# EAGLE design OSO-MISC-22-001 Temperature + GPIO + I2C (EAGLE 9.6.2)
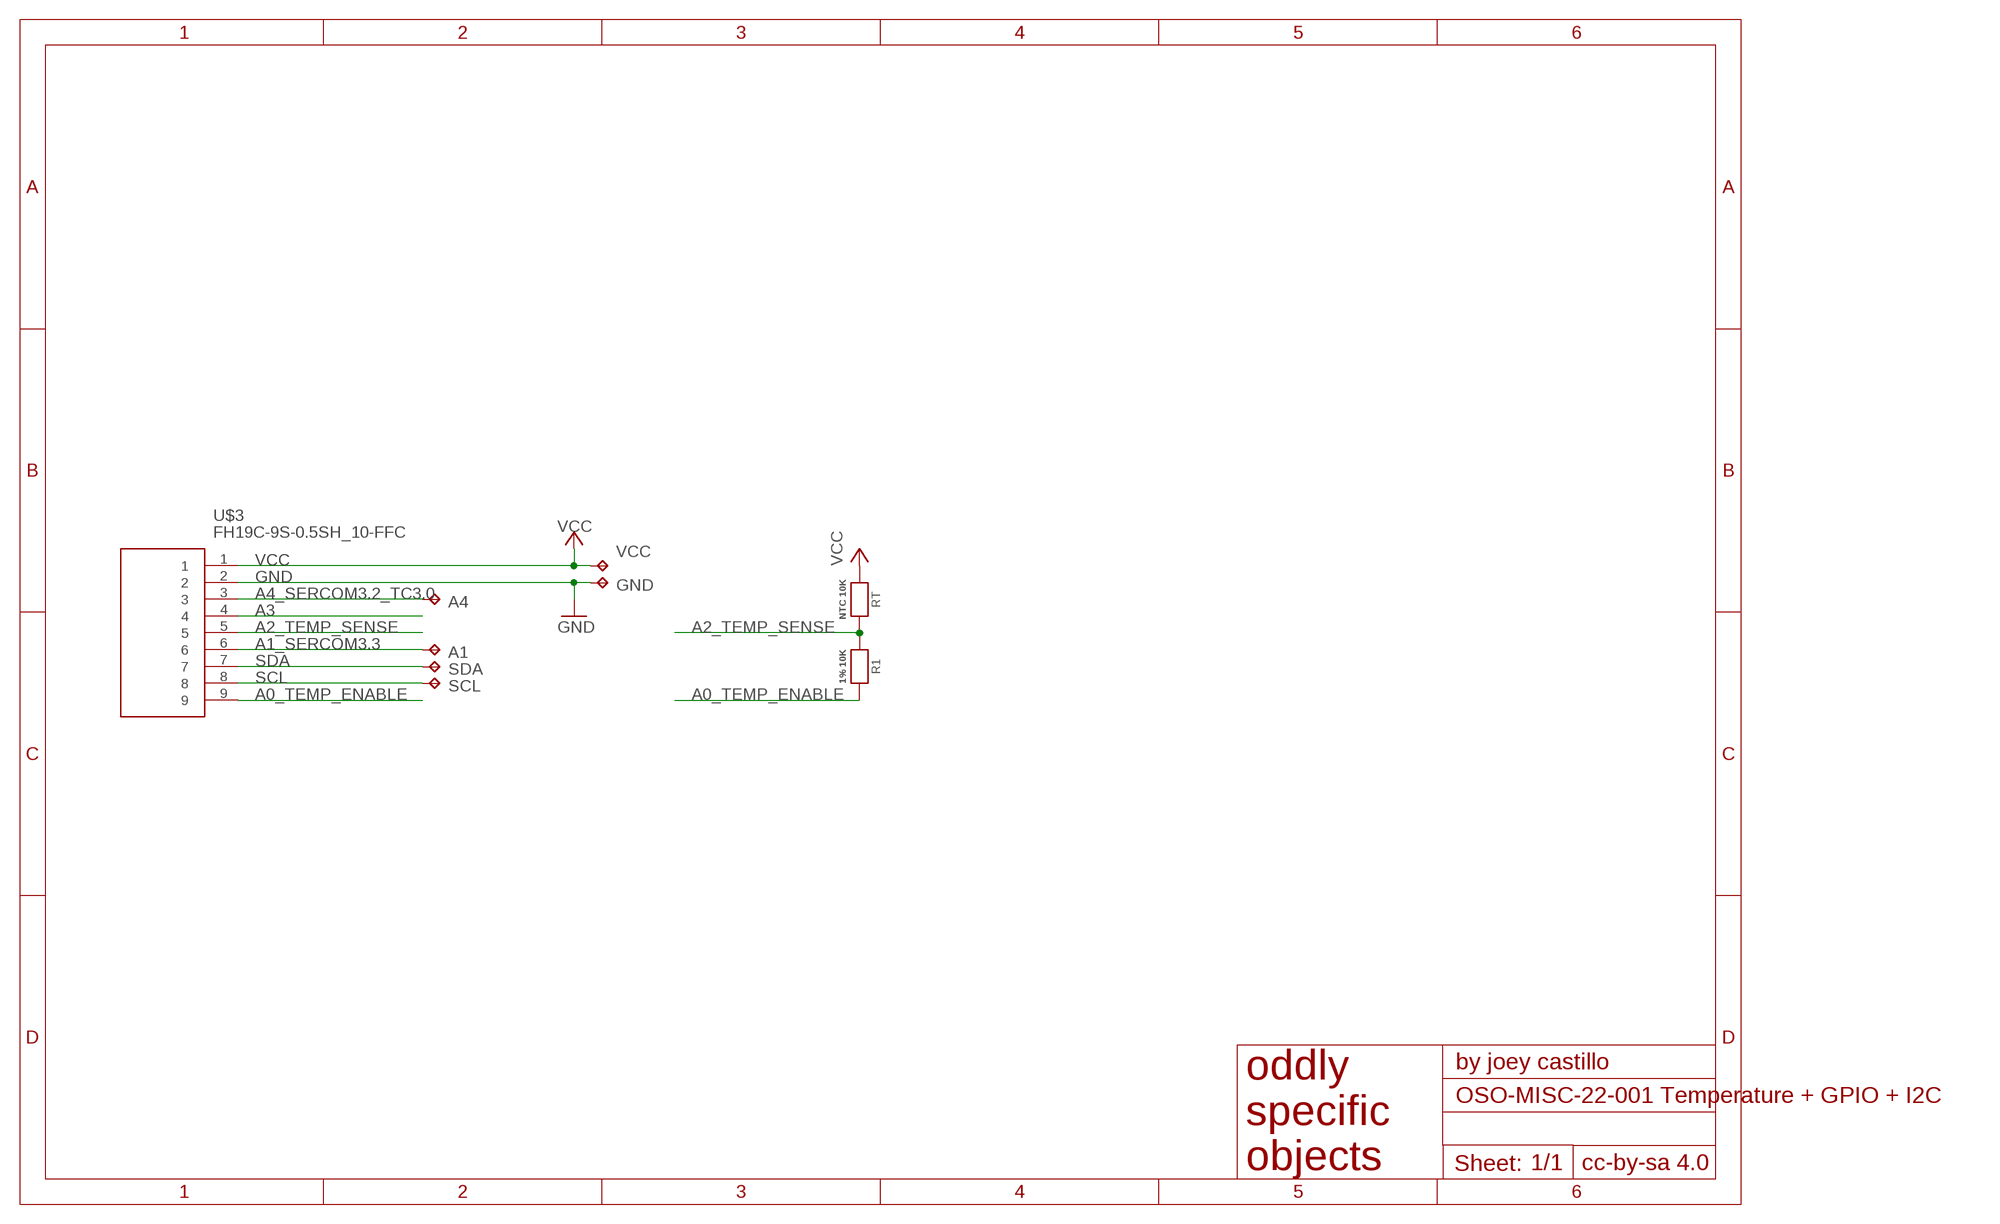
[diagram p0: schematic, sheet 1]

## Parts
A1  TPB1,27  [B1,27]
A4  TPB1,27  [B1,27]
GND  TPB1,27  [B1,27]
R1  1% 10K  RESISTOR_0603MP  [_0603MP]
RT  NTC 10K  RESISTOR_0603MP  [_0603MP]
SCL  TPB1,27  [B1,27]
SDA  TPB1,27  [B1,27]
U$3  FH19C-9S-0.5SH_10-FFC  [FH19C9S05SH10-FFC]
VCC  TPB1,27  [B1,27]

## Nets
A0_TEMP_ENABLE: R1.2 U$3.9
A1_SERCOM3.3: A1.TP U$3.6
A2_TEMP_SENSE: R1.1 RT.2 U$3.5
A3: U$3.4
A4_SERCOM3.2_TC3.0: A4.TP U$3.3
GND [gnd]: GND.TP U$3.2
SCL: SCL.TP U$3.8
SDA: SDA.TP U$3.7
VCC [power]: RT.1 U$3.1 VCC.TP

## Library data of the parts
A1 A4 GND SCL SDA VCC = testpad:TP: Test pad
R1 RT = microbuilder:RESISTOR: Resistors For new designs, use the packages preceded by an '_' character since they are more reliable: The following footprints should be used on most boards: _0402 - Standard footprint for regular board layouts _0603 - Standard footprint for regular board layouts _0805 - Standard footprint for regular board layouts _1206 - Standard footprint for regular board layouts For extremely tight-pitch boards where space is at a premium, the following 'micro-pitch' footprints can be used (smaller pads, no silkscreen outline, etc.): _0402MP - Micro-pitch footprint for very dense/compact boards _0603MP - Micro-pitch footprint for very dense/compact boards _0805MP - Micro-pitch footprint for very dense/compact boards _1206MP - Micro-pitch footprint for very dense/compact boards
U$3 = FH19C-9S-0.5SH:FH19C-9S-0.5SH_10-FFC

## Net classes
0 default: width 0.203 mm
1 power: width 0.203 mm
2 gnd: width 0.203 mm

## Board
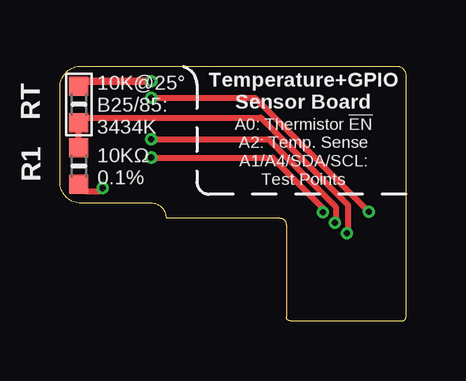
[diagram p1: board, top side]
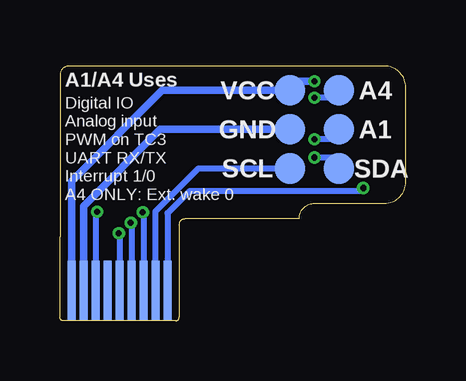
[diagram p2: board, bottom side, seen from below]

Size 14.43 x 10.61 mm. Coordinates in mm from the lower left corner, seen from the top.
Outline: 14.43,3.5 14.43,10.23 arc90 14.05,10.61 0.89,10.61 arc90 0,9.72 0,5.79 arc90 0.89,4.9 3.81,4.9 arc-90 4.45,4.26 9.2,4.26 arc-90 9.45,4.01 9.45,3.5
Copper layers (1*16): Top 0.035559375mm / dielectric 1.6mm / Bottom 0.035559375mm
Design rules "oshpark-2layer *": minimum track width 6mil, minimum drill 10mil, track to track 6mil, track to pad 6mil, pad to pad 6mil, via to via 6mil, smd to smd 6mil, copper to edge 15mil, drill to drill 6mil, minimum pad ring 5mil, minimum via ring 5mil, stop-mask expansion 2.5mil, vias tented up to drill 12mil, thermal gap 10mil

### Footprints (pad centres in the part's own frame; a part is rotated, then mirrored left to right if it is on the bottom)
B1,27 = smd 1.27 x 1.27: TP 0,0
_0603MP = smd 0.8 x 0.8: 1 -0.762,0; 2 0.762,0
FH19C9S05SH10-FFC = smd 0.347 x 2.5 bottom: 1 2,-2.25; 2 1.5,-2.25; 3 1,-2.25; 4 0.5,-2.25; 5 0,-2.25; 6 -0.5,-2.25; 7 -1,-2.25; 8 -1.5,-2.25; 9 -2,-2.25

### Placement (x,y rotation side)
A1  2.79,7.97 0 bottom
A4  2.79,9.6 0 bottom
GND  4.83,7.97 0 bottom
R1  0.79,6.45 270 top
RT  0.79,9.01 270 top
SCL  4.83,6.34 0 bottom
SDA  2.79,6.34 0 bottom
U$3  11.94,3.5 0 top
VCC  4.83,9.6 0 bottom

### Tracks (layer width: path | path; a pad name or v marks a point on that pad's centre or on a via)
A0_TEMP_ENABLE  (via drill 0.25)
  Top 0.254: R1.2 1.07,5.41 1.65,5.41 v1.78,5.53
  Bottom 0.254: U$3.9 9.94,4.48 9.02,5.41 1.91,5.41 v1.78,5.53
A1_SERCOM3.3  (via drill 0.25)
  Top 0.254: v11.47,4.08 11.51,4.12 11.51,4.75 8.69,7.56 v3.81,7.56
  Bottom 0.254: v11.47,4.08 11.44,4.05 U$3.6 | A1.TP 2.79,7.72 2.95,7.56 v3.81,7.56
A2_TEMP_SENSE  (via drill 0.25)
  Top 0.254: v11.97,3.65 12.01,3.68 12.01,4.84 8.38,8.47 1,8.47 RT.2 R1.1
  Bottom 0.254: v11.97,3.65 11.94,3.62 U$3.5
A4_SERCOM3.2_TC3.0  (via drill 0.25)
  Top 0.254: v3.81,9.29 8.14,9.29 v12.88,4.55
  Bottom 0.254: v3.81,9.29 3.05,9.29 3.05,9.34 A4.TP | v12.88,4.55 12.94,4.49 U$3.3
GND
  Bottom 0.305: U$3.2 13.44,4.78 10.25,7.97 GND.TP
SCL
  Bottom 0.254: U$3.8 10.44,4.56 8.65,6.35 SCL.TP
SDA  (via drill 0.25)
  Top 0.254: v3.81,6.8 8.87,6.8 10.97,4.7 v10.97,4.52
  Bottom 0.254: SDA.TP 2.79,6.8 v3.81,6.8 | v10.97,4.52 10.94,4.48 U$3.7
VCC  (via drill 0.25)
  Top 0.305: RT.1 0.99,9.98 v3.81,9.98
  Bottom 0.305: v3.81,9.98 4.45,9.98 VCC.TP 10.16,9.6 13.94,5.82 U$3.1

### Text on the board
tPlace: Temperature+GPIO / Sensor Board | 10K@25° / B25/85: / 3434K | A0: Thermistor !EN / A2: Temp. Sense / A1/A4/SDA/SCL: / Test Points | 10KΩ / 0.1%
bPlace: A1/A4 Uses | Digital IO / Analog input / PWM on TC3 / UART RX/TX / Interrupt 1/0 / A4 ONLY: Ext. wake 0